# Altium schematic sheet HDMI.SchDoc: HDMI
size A3; Author: Silvio Navaretti; CompanyName: ARDUINO; DrawnBy: Silvio Navaretti; Engineer: Silvio Navaretti; Organization: ARDUINO; SheetNumber: 43; SheetTotal: 50; RevAuthor: Silvio Navaretti
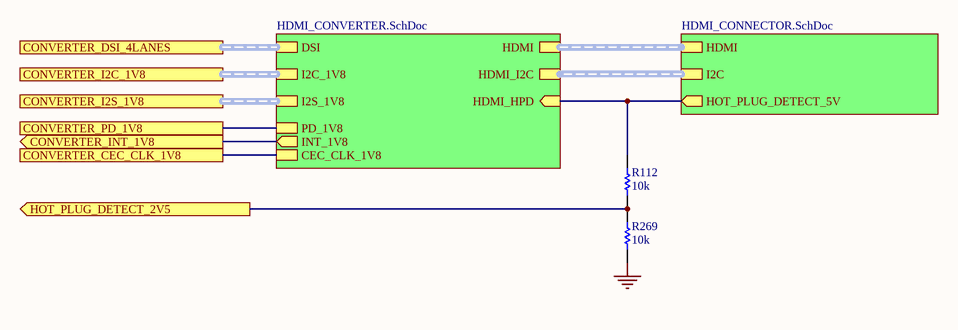
[diagram p0: HDMI.SchDoc]

## Parts
R112  value 10k  [RES-0201]  (hidden comment: RC0201FR-0710KL)
R269  value 10k  [RES-0201]  (hidden comment: RC0201FR-0710KL)

## Sub-sheets
U_HDMI_CONNECTOR = HDMI_CONNECTOR.SchDoc: HDMI (harness HDMI), I2C (harness I2C), HOT_PLUG_DETECT_5V (out)
U_HDMI_CONVERTER = HDMI_CONVERTER.SchDoc: DSI (harness MIPI_4LANES), HDMI_I2C (harness I2C), HDMI (harness HDMI), HDMI_HPD (in), I2C_1V8 (harness I2C), I2S_1V8 (harness SOM_MD_I2S), PD_1V8, INT_1V8 (out), CEC_CLK_1V8

## Ports
CONVERTER_CEC_CLK_1V8, CONVERTER_DSI_4LANES (harness MIPI_4LANES), CONVERTER_I2C_1V8 (harness MIPI_4LANES), CONVERTER_I2S_1V8 (harness MIPI_4LANES), CONVERTER_INT_1V8 (out), CONVERTER_PD_1V8, HOT_PLUG_DETECT_2V5 (out)

## Nets
GND: R269.1
CONVERTER_CEC_CLK_1V8: port CONVERTER_CEC_CLK_1V8, sheet U_HDMI_CONVERTER/CEC_CLK_1V8
CONVERTER_INT_1V8: port CONVERTER_INT_1V8, sheet U_HDMI_CONVERTER/INT_1V8
CONVERTER_PD_1V8: port CONVERTER_PD_1V8, sheet U_HDMI_CONVERTER/PD_1V8
HOT_PLUG_DETECT_2V5: R112.1 R269.2 ; port HOT_PLUG_DETECT_2V5
NetR112_2: R112.2 ; sheet U_HDMI_CONNECTOR/HOT_PLUG_DETECT_5V, sheet U_HDMI_CONVERTER/HDMI_HPD

## Buses and harness runs
harness port CONVERTER_DSI_4LANES = sheet U_HDMI_CONVERTER/DSI
harness port CONVERTER_I2C_1V8 = sheet U_HDMI_CONVERTER/I2C_1V8
harness port CONVERTER_I2S_1V8 = sheet U_HDMI_CONVERTER/I2S_1V8
harness sheet U_HDMI_CONNECTOR/HDMI = sheet U_HDMI_CONVERTER/HDMI
harness sheet U_HDMI_CONNECTOR/I2C = sheet U_HDMI_CONVERTER/HDMI_I2C

## Notes on the sheet
- Title:
- ID:
- Date:
- Time:
- Version:
- Sheet
- of
- RevAuthor:
- Reference Designs ARE PROVIDED "AS IS" AND "WITH ALL FAULTS. Arduino SA DISCLAIMS ALL OTHER WARRANTIES, EXPRESS OR IMPLIED, REGARDING PRODUCTS, INCLUDING BUT NOT LIMITED TO, ANY IMPLIED WARRANTIES OF MERCHANTABILITY OR FITNESS FOR A PARTICULAR PURPOSE.
  Arduino SA may make changes to specifications and product descriptions at any time, without notice. The Customer must not rely on the absence or characteristics of any features or instructions marked "reserved" or "undefined".
  Arduino SA reserves these for future definition and shall have no responsibility whatsoever for conflicts or incompatibilities arising from future changes to them. The product information on the Web Site or Materials is subject to change without notice.
  Do not finalize a design with this info. ARDUINO and other Arduino brands and logos and Trademarks of Arduino SA. All Arduino SA Trademarks cannot be used without owner's formal permission.
- File:
- Author:

## Library data of the parts
R112 R269 = R0145-A.21: RES CHIP 0201 10k 1% 1/20W; Manufacturer: Yageo; Power: 50mW; Temperature coefficient: 200ppm; Code Arduino: R0145; Manufacturer 2: Samsung Electro-Mechanics; Tolerance: 1%; Case Code (Imperial): 0201; Part Number: RC0201FR-0710KL; Technology: Thick film